# Altium schematic sheet OpenPack_BATMOD_V2p0_MAN.SchDoc
size A4; SheetNumber: 4; SheetTotal: 9; Title_: USB C Manager
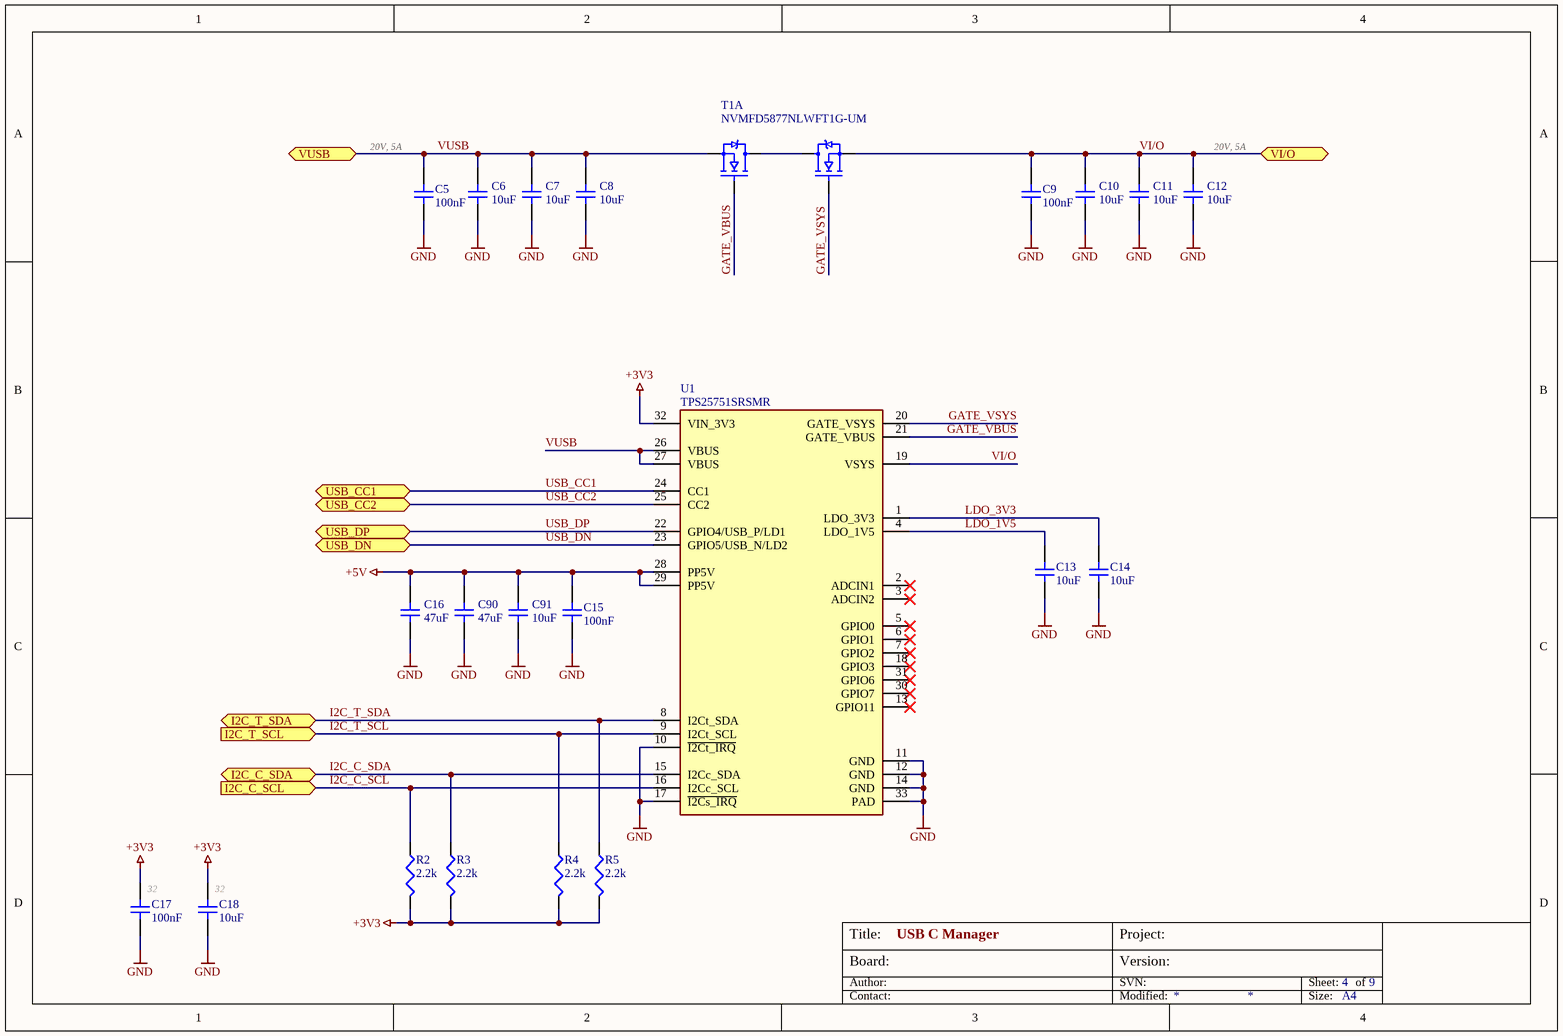
[diagram p0: OpenPack_BATMOD_V2p0_MAN.SchDoc]

## Parts
C5  100nF  [CAP_0603]
C6  10uF  [CAP_1210]
C7  10uF  [CAP_1210]
C8  10uF  [CAP_1210]
C9  100nF  [CAP_0603]
C10  10uF  [CAP_1210]
C11  10uF  [CAP_1210]
C12  10uF  [CAP_1210]
C13  10uF  [CAP_0603]
C14  10uF  [CAP_0603]
C15  100nF  [CAP_0603]
C16  47uF  [CAP_1210]
C17  100nF  [CAP_0603]
C18  10uF  [CAP_0603]
C90  47uF  [CAP_1210]
C91  10uF  [CAP_1210]
R2  2.2k  [RES-0603]
R3  2.2k  [RES-0603]
R4  2.2k  [RES-0603]
R5  2.2k  [RES-0603]
T1  NVMFD5877NLWFT1G-UM  [SO-8FL (DFN8)]  (parts A,B of 2)
U1  TPS25751SRSMR  [QFN32 - 0.4mm]

## Ports
I2C_C_SCL (in, see OpenPack_BATMOD_V2p0_MAIN, OpenPack_BATMOD_V2p0_MCU), I2C_C_SDA (bidir, see OpenPack_BATMOD_V2p0_MAIN, OpenPack_BATMOD_V2p0_MCU), I2C_T_SCL (in, see OpenPack_BATMOD_V2p0_MAIN, OpenPack_BATMOD_V2p0_MCU), I2C_T_SDA (bidir, see OpenPack_BATMOD_V2p0_MAIN, OpenPack_BATMOD_V2p0_MCU), USB_CC1 (bidir, see OpenPack_BATMOD_V2p0_MAIN, OpenPack_BATMOD_V2p0_USBC), USB_CC2 (bidir, see OpenPack_BATMOD_V2p0_MAIN, OpenPack_BATMOD_V2p0_USBC), USB_DN (bidir, see OpenPack_BATMOD_V2p0_MAIN, OpenPack_BATMOD_V2p0_USBC), USB_DP (bidir, see OpenPack_BATMOD_V2p0_MAIN, OpenPack_BATMOD_V2p0_USBC), VI/O (bidir, see OpenPack_BATMOD_V2p0_MAIN, OpenPack_BATMOD_V2p0_CHRG), VUSB (bidir, see OpenPack_BATMOD_V2p0_MAIN, OpenPack_BATMOD_V2p0_USBC)

## Nets
+3V3: C17.2 C18.2 R2.2 R3.2 R4.2 R5.2 U1.32(VIN_3V3)
+5V: C15.2 C16.2 C90.2 C91.2 U1.28(PP5V) U1.29(PP5V)
GND: C5.1 C6.1 C7.1 C8.1 C9.1 C10.1 C11.1 C12.1 C13.1 C14.1 C15.1 C16.1 C17.1 C18.1 C90.1 C91.1 U1.10(~{I2Ct_IRQ}) U1.11(GND) U1.12(GND) U1.14(GND) U1.17(~{I2Cs_IRQ}) U1.33(PAD)
GATE_VBUS: T1.4 U1.21(GATE_VBUS)
GATE_VSYS: T1.2 U1.20(GATE_VSYS)
I2C_C_SCL: R2.1 U1.16(I2Cc_SCL) ; port I2C_C_SCL
I2C_C_SDA: R3.1 U1.15(I2Cc_SDA) ; port I2C_C_SDA
I2C_T_SCL: R4.1 U1.9(I2Ct_SCL) ; port I2C_T_SCL
I2C_T_SDA: R5.1 U1.8(I2Ct_SDA) ; port I2C_T_SDA
LDO_1V5: C13.2 U1.4(LDO_1V5)
LDO_3V3: C14.2 U1.1(LDO_3V3)
USB_CC1: U1.24(CC1) ; port USB_CC1
USB_CC2: U1.25(CC2) ; port USB_CC2
USB_DN: U1.23(GPIO5/USB_N/LD2) ; port USB_DN
USB_DP: U1.22(GPIO4/USB_P/LD1) ; port USB_DP
VI/O: C9.2 C10.2 C11.2 C12.2 T1.1 U1.19(VSYS) ; port VI/O
VUSB: C5.2 C6.2 C7.2 C8.2 T1.3 U1.26(VBUS) U1.27(VBUS) ; port VUSB
NetT1_9: T1.9 T1.10

Not connected (* = marked no-connect by the designer): U1 2(ADCIN1)* 3(ADCIN2)* 5(GPIO0)* 6(GPIO1)* 7(GPIO2)* 13(GPIO11)* 18(GPIO3)* 30(GPIO7)* 31(GPIO6)*

## Notes on the sheet
- (near C5) 20V, 5A
- (near C12) 20V, 5A
- (near C17) 32
- (near C18) 32
- Board:
- Author:
- Title:
- Project:
- SVN:
- Version:
- Sheet:
- of
- Contact:
- Modified:
- Size:
- A4

## Library data of the parts
C5 C9 C13-C15 C17 C18 = NP-CAPACITOR: MLCC capacitor; Type: CAP
C6-C8 C10-C12 C91 = NP-CAPACITOR: UMK325BJ106KM-P; Part number: 810-CGA6P1X7R1N106K2; Type: CAP; Supplier: Mouser
C16 C90 = NP-CAPACITOR: Np-Cap; Part number: 80-C1210C476M4P; Type: CAP; Supplier: Mouser
R2-R5 = RESISTOR: Metal Film Resistor; Type: RES
T1 = NVMFD5877NLWFT1G-UM: Power NMOSFET Dual, 60V, 17A, 36mΩ; Part number: 863-FD5877NLWFT1G-UM; Type: FET; ComponentLink1Description: Datasheet; Supplier: Mouser; ComponentLink2Description: Order; ComponentLink2URL: https://hu.mouser.com/en/ProductDetail/onsemi/NVMFD5877NLWFT1G-UM?qs=PBDs2xEllI96pZN4%2F5B02g%3D%3D
U1 = TPS25751SRSMR: USB Interface IC USB Type-C and USB P ower Delivery (PD); Part number: 595-TPS25751SRSMR; ComponentLink1Description: Datasheet; Supplier: Mouser; ComponentLink2Description: Order; ComponentLink2URL: https://hu.mouser.com/en/ProductDetail/Texas-Instruments/TPS25751SRSMR?qs=2wMNvWM5ZX4s3a9I%252B6VO9w%3D%3D; Type: IC